# EAGLE schematic IDC distributor (EAGLE 6.2)
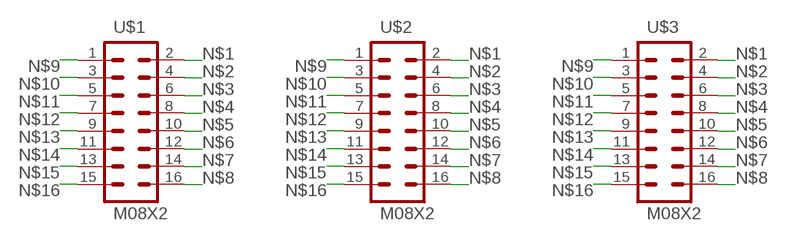
[diagram p0: schematic, sheet 1]

## Parts
U$1  M08X2  [2X8]
U$2  M08X2  [2X8]
U$3  M08X2  [2X8]

## Nets
N$1: U$1.2 U$2.2 U$3.2
N$2: U$1.4 U$2.4 U$3.4
N$3: U$1.6 U$2.6 U$3.6
N$4: U$1.8 U$2.8 U$3.8
N$5: U$1.10 U$2.10 U$3.10
N$6: U$1.12 U$2.12 U$3.12
N$7: U$1.14 U$2.14 U$3.14
N$8: U$1.16 U$2.16 U$3.16
N$9: U$1.1 U$2.1 U$3.1
N$10: U$1.3 U$2.3 U$3.3
N$11: U$1.5 U$2.5 U$3.5
N$12: U$1.7 U$2.7 U$3.7
N$13: U$1.9 U$2.9 U$3.9
N$14: U$1.11 U$2.11 U$3.11
N$15: U$1.13 U$2.13 U$3.13
N$16: U$1.15 U$2.15 U$3.15

## Library data of the parts
U$1-U$3 = SparkFun:M08X2

## Net classes
0 default: width 0.254 mm, drill 0.406 mm, clearance 0.203 mm